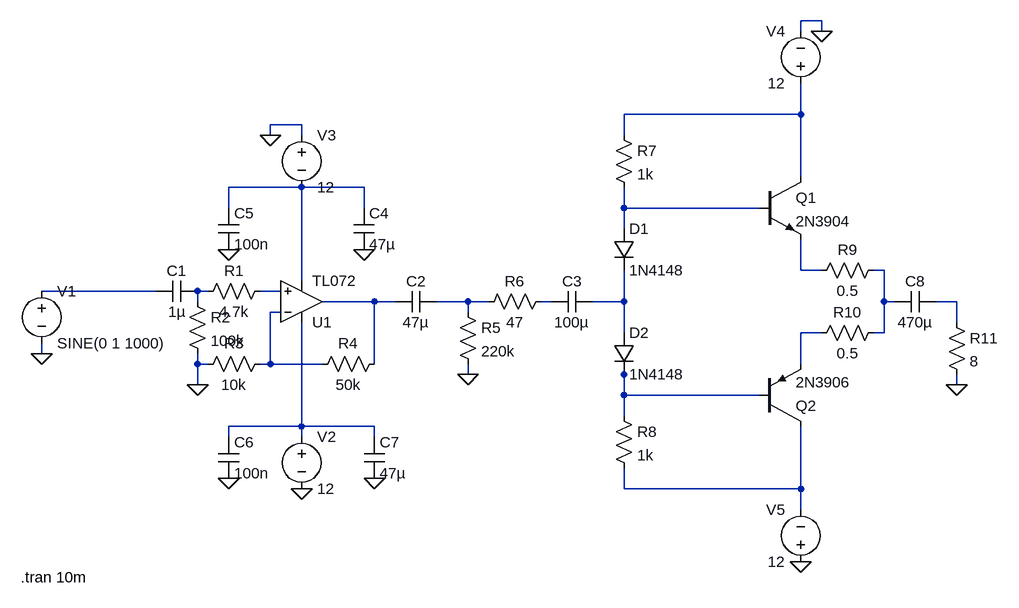
[diagram p0: schematic class_ab_simulation.asc]
class_ab_simulation.asc, the LTspice schematic file:
Version 4
SHEET 1 1252 680
WIRE 976 -432 944 -432
WIRE 944 -416 944 -432
WIRE 976 -416 976 -432
WIRE 944 -288 944 -336
WIRE 944 -288 672 -288
WIRE 176 -272 128 -272
WIRE 128 -256 128 -272
WIRE 176 -256 176 -272
WIRE 672 -256 672 -288
WIRE 944 -192 944 -288
WIRE 176 -176 64 -176
WIRE 272 -176 176 -176
WIRE 64 -144 64 -176
WIRE 272 -144 272 -176
WIRE 672 -144 672 -176
WIRE 880 -144 672 -144
WIRE 672 -112 672 -144
WIRE 944 -48 944 -96
WIRE 976 -48 944 -48
WIRE 1072 -48 1056 -48
WIRE 176 -32 176 -176
WIRE -48 -16 -224 -16
WIRE 32 -16 16 -16
WIRE 144 -16 112 -16
WIRE 16 0 16 -16
WIRE 288 0 208 0
WIRE 320 0 288 0
WIRE 432 0 384 0
WIRE 464 0 432 0
WIRE 560 0 544 0
WIRE 672 0 672 -48
WIRE 672 0 624 0
WIRE 1072 0 1072 -48
WIRE 1088 0 1072 0
WIRE 1184 0 1152 0
WIRE 144 16 128 16
WIRE 432 16 432 0
WIRE 1184 32 1184 0
WIRE 672 48 672 0
WIRE 976 48 944 48
WIRE 1072 48 1072 0
WIRE 1072 48 1056 48
WIRE -224 80 -224 64
WIRE 16 96 16 80
WIRE 32 96 16 96
WIRE 128 96 128 16
WIRE 128 96 112 96
WIRE 208 96 128 96
WIRE 288 96 288 0
WIRE 944 96 944 48
WIRE 432 112 432 96
WIRE 672 112 672 96
WIRE 16 128 16 96
WIRE 1184 128 1184 112
WIRE 672 144 672 112
WIRE 880 144 672 144
WIRE 672 176 672 144
WIRE 176 192 176 32
WIRE 176 192 64 192
WIRE 288 192 176 192
WIRE 64 208 64 192
WIRE 176 208 176 192
WIRE 288 208 288 192
WIRE 672 288 672 256
WIRE 944 288 944 192
WIRE 944 288 672 288
WIRE 944 320 944 288
FLAG -224 80 0
FLAG 432 112 0
FLAG 64 272 0
FLAG 288 272 0
FLAG 176 288 0
FLAG 64 -80 0
FLAG 272 -80 0
FLAG 128 -256 0
FLAG 1184 128 0
FLAG 944 400 0
FLAG 976 -416 0
FLAG 16 128 0
SYMBOL OpAmps\\TL072 176 64 M180
SYMATTR InstName U1
SYMBOL res 128 -32 R90
WINDOW 0 0 56 VBottom 2
WINDOW 3 32 56 VTop 2
SYMATTR InstName R1
SYMATTR Value 4.7k
SYMBOL cap 16 -32 R90
WINDOW 0 0 32 VBottom 2
WINDOW 3 32 32 VTop 2
SYMATTR InstName C1
SYMATTR Value 1µ
SYMBOL voltage -224 -32 R0
WINDOW 123 0 0 Left 0
WINDOW 39 0 0 Left 0
SYMATTR InstName V1
SYMATTR Value SINE(0 1 1000)
SYMBOL res 0 -16 R0
SYMATTR InstName R2
SYMATTR Value 100k
SYMBOL res 128 80 R90
WINDOW 0 0 56 VBottom 2
WINDOW 3 32 56 VTop 2
SYMATTR InstName R3
SYMATTR Value 10k
SYMBOL res 304 80 R90
WINDOW 0 0 56 VBottom 2
WINDOW 3 32 56 VTop 2
SYMATTR InstName R4
SYMATTR Value 50k
SYMBOL cap 384 -16 R90
WINDOW 0 0 32 VBottom 2
WINDOW 3 32 32 VTop 2
SYMATTR InstName C2
SYMATTR Value 47µ
SYMBOL res 416 0 R0
SYMATTR InstName R5
SYMATTR Value 220k
SYMBOL res 560 -16 R90
WINDOW 0 0 56 VBottom 2
WINDOW 3 32 56 VTop 2
SYMATTR InstName R6
SYMATTR Value 47
SYMBOL cap 624 -16 R90
WINDOW 0 0 32 VBottom 2
WINDOW 3 32 32 VTop 2
SYMATTR InstName C3
SYMATTR Value 100µ
SYMBOL cap 256 -144 R0
SYMATTR InstName C4
SYMATTR Value 47µ
SYMBOL cap 48 -144 R0
SYMATTR InstName C5
SYMATTR Value 100n
SYMBOL voltage 176 192 R0
WINDOW 123 0 0 Left 0
WINDOW 39 0 0 Left 0
SYMATTR InstName V2
SYMATTR Value 12
SYMBOL cap 48 208 R0
SYMATTR InstName C6
SYMATTR Value 100n
SYMBOL cap 272 208 R0
SYMATTR InstName C7
SYMATTR Value 47µ
SYMBOL voltage 176 -272 R0
WINDOW 123 0 0 Left 0
WINDOW 39 0 0 Left 0
SYMATTR InstName V3
SYMATTR Value 12
SYMBOL diode 656 -112 R0
SYMATTR InstName D1
SYMATTR Value 1N4148
SYMBOL diode 656 48 R0
SYMATTR InstName D2
SYMATTR Value 1N4148
SYMBOL res 656 -272 R0
SYMATTR InstName R7
SYMATTR Value 1k
SYMBOL res 656 160 R0
SYMATTR InstName R8
SYMATTR Value 1k
SYMBOL npn 880 -192 R0
SYMATTR InstName Q1
SYMATTR Value 2N3904
SYMBOL pnp 880 192 M180
SYMATTR InstName Q2
SYMATTR Value 2N3906
SYMBOL res 1072 -64 R90
WINDOW 0 0 56 VBottom 2
WINDOW 3 32 56 VTop 2
SYMATTR InstName R9
SYMATTR Value 0.5
SYMBOL res 1072 32 R90
WINDOW 0 0 56 VBottom 2
WINDOW 3 32 56 VTop 2
SYMATTR InstName R10
SYMATTR Value 0.5
SYMBOL cap 1152 -16 R90
WINDOW 0 0 32 VBottom 2
WINDOW 3 32 32 VTop 2
SYMATTR InstName C8
SYMATTR Value 470µ
SYMBOL res 1168 16 R0
SYMATTR InstName R11
SYMATTR Value 8
SYMBOL voltage 944 -320 R180
WINDOW 0 24 96 Left 2
WINDOW 3 24 16 Left 2
WINDOW 123 0 0 Left 0
WINDOW 39 0 0 Left 0
SYMATTR InstName V4
SYMATTR Value 12
SYMBOL voltage 944 416 R180
WINDOW 0 24 96 Left 2
WINDOW 3 24 16 Left 2
WINDOW 123 0 0 Left 0
WINDOW 39 0 0 Left 0
SYMATTR InstName V5
SYMATTR Value 12
TEXT -256 424 Left 2 !.tran 10m

The netlist it stands for:
* class_ab_simulation.asc
XU1 N008 N014 N017 N002 N009 TL072  ; pins In+ In- V+ V- OUT
R1 N008 N007 4.7k
C1 N007 N006 1µ
V1 N006 0 SINE(0 1 1000)
R2 N007 0 100k
R3 N014 0 10k
R4 N009 N014 50k
C2 N010 N009 47µ
R5 N010 0 220k
R6 N011 N010 47
C3 N012 N011 100µ
C4 N002 0 47µ
C5 N002 0 100n
V2 N017 0 12
C6 N017 0 100n
C7 N017 0 47µ
V3 0 N002 12
D1 N003 N012 1N4148
D2 N012 N016 1N4148
R7 N001 N003 1k
R8 N016 N018 1k
Q1 N001 N003 N004 0 2N3904
Q2 N018 N016 N015 0 2N3906
R9 N005 N004 0.5
R10 N005 N015 0.5
C8 N013 N005 470µ
R11 N013 0 8
V4 N001 0 12
V5 0 N018 12
.model D D
.lib standard.dio
.model NPN NPN
.model PNP PNP
.lib standard.bjt
.tran 10m
.backanno
.end